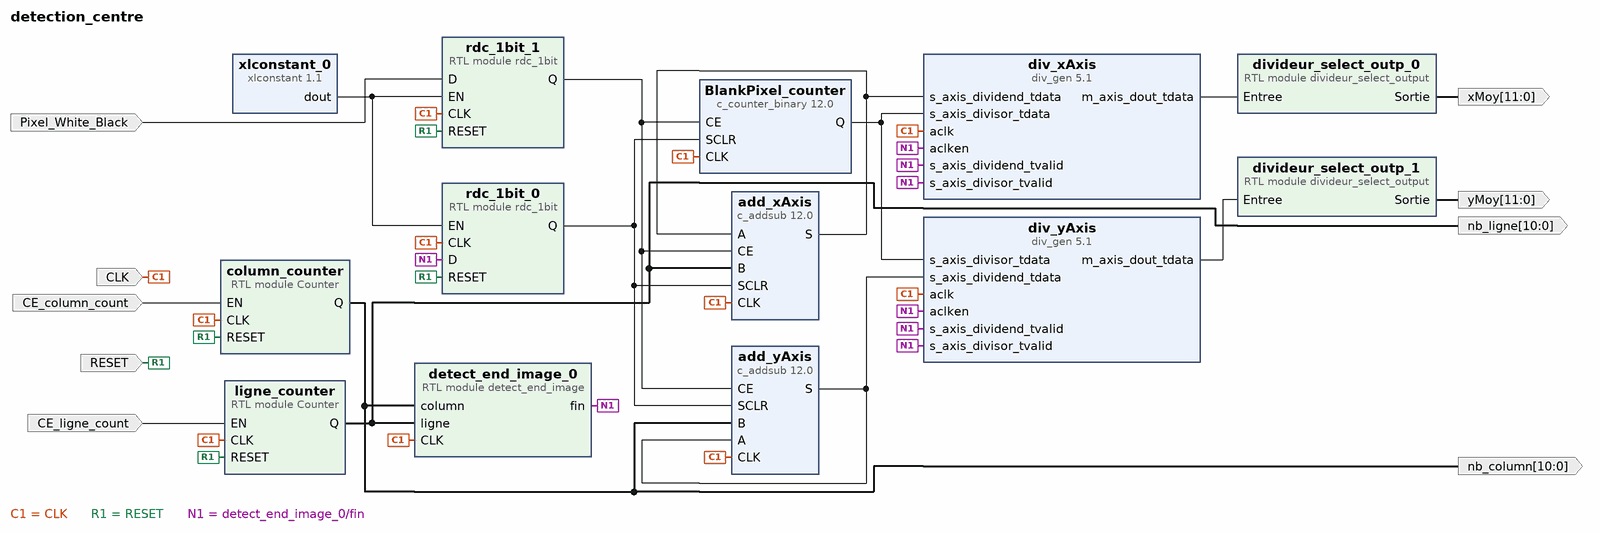
[diagram p0: block diagram of the top level]
# Vivado block design detection_centre, xc7z020clg400-1, Vivado 2018.2.1
create_bd_design detection_centre

create_bd_port -dir I CE_ligne_count
create_bd_port -dir I CLK
create_bd_port -dir I RESET
create_bd_port -dir O -from 10 -to 0 nb_ligne
create_bd_port -dir O -from 11 -to 0 xMoy
create_bd_port -dir O -from 11 -to 0 yMoy
create_bd_port -dir O -from 10 -to 0 nb_column
create_bd_port -dir I Pixel_White_Black
create_bd_port -dir I CE_column_count

create_bd_cell -type ip -vlnv xilinx.com:ip:c_addsub:12.0 add_yAxis
set_property -dict [list \
  CONFIG.A_Type Unsigned \
  CONFIG.B_Type Unsigned \
  CONFIG.A_Width 18 \
  CONFIG.B_Width 11 \
  CONFIG.Out_Width 18 \
  CONFIG.Latency 1 \
  CONFIG.B_Value 00000000000 \
  CONFIG.CE true \
  CONFIG.SCLR true \
  CONFIG.SSET false \
] [get_bd_cells add_yAxis]
create_bd_cell -type ip -vlnv xilinx.com:ip:div_gen:5.1 div_yAxis
set_property -dict [list \
  CONFIG.algorithm_type Radix2 \
  CONFIG.dividend_and_quotient_width 18 \
  CONFIG.dividend_has_tuser false \
  CONFIG.dividend_has_tlast false \
  CONFIG.divisor_width 11 \
  CONFIG.remainder_type Remainder \
  CONFIG.fractional_width 11 \
  CONFIG.operand_sign Unsigned \
  CONFIG.clocks_per_division 1 \
  CONFIG.divide_by_zero_detect false \
  CONFIG.OutTLASTBehv Null \
  CONFIG.latency 20 \
  CONFIG.ACLKEN true \
] [get_bd_cells div_yAxis]
create_bd_cell -type ip -vlnv xilinx.com:ip:c_counter_binary:12.0 BlankPixel_counter
set_property -dict [list \
  CONFIG.Output_Width 11 \
  CONFIG.Restrict_Count false \
  CONFIG.CE true \
  CONFIG.SCLR true \
  CONFIG.SSET false \
] [get_bd_cells BlankPixel_counter]
create_bd_cell -type ip -vlnv xilinx.com:ip:xlconstant:1.1 xlconstant_0
create_bd_cell -type ip -vlnv xilinx.com:ip:c_addsub:12.0 add_xAxis
set_property -dict [list \
  CONFIG.A_Type Unsigned \
  CONFIG.B_Type Unsigned \
  CONFIG.A_Width 18 \
  CONFIG.B_Width 11 \
  CONFIG.Out_Width 18 \
  CONFIG.Latency 1 \
  CONFIG.B_Value 00000000000 \
  CONFIG.CE true \
  CONFIG.SCLR true \
  CONFIG.SSET false \
] [get_bd_cells add_xAxis]
create_bd_cell -type ip -vlnv xilinx.com:ip:div_gen:5.1 div_xAxis
set_property -dict [list \
  CONFIG.algorithm_type Radix2 \
  CONFIG.dividend_and_quotient_width 18 \
  CONFIG.dividend_has_tuser false \
  CONFIG.dividend_has_tlast false \
  CONFIG.divisor_width 11 \
  CONFIG.remainder_type Remainder \
  CONFIG.fractional_width 11 \
  CONFIG.operand_sign Unsigned \
  CONFIG.clocks_per_division 1 \
  CONFIG.divide_by_zero_detect false \
  CONFIG.OutTLASTBehv Null \
  CONFIG.latency 20 \
  CONFIG.ACLKEN true \
] [get_bd_cells div_xAxis]
create_bd_cell -type module -reference rdc_1bit rdc_1bit_0
create_bd_cell -type module -reference rdc_1bit rdc_1bit_1
create_bd_cell -type module -reference divideur_select_output divideur_select_outp_0
create_bd_cell -type module -reference divideur_select_output divideur_select_outp_1
create_bd_cell -type module -reference detect_end_image detect_end_image_0
create_bd_cell -type module -reference Counter column_counter
set_property -dict {CONFIG.N 11} [get_bd_cells column_counter]
create_bd_cell -type module -reference Counter ligne_counter
set_property -dict {CONFIG.N 11} [get_bd_cells ligne_counter]

# ---- connections ----

connect_bd_net [get_bd_ports CLK] \
  [get_bd_pins BlankPixel_counter/CLK] [get_bd_pins add_xAxis/CLK] [get_bd_pins div_xAxis/aclk] [get_bd_pins div_yAxis/aclk] \
  [get_bd_pins add_yAxis/CLK] [get_bd_pins rdc_1bit_0/CLK] [get_bd_pins rdc_1bit_1/CLK] [get_bd_pins detect_end_image_0/CLK] \
  [get_bd_pins column_counter/CLK] [get_bd_pins ligne_counter/CLK]
connect_bd_net -net RESET_counter_ligne_and_column_1 [get_bd_ports RESET] \
  [get_bd_pins rdc_1bit_0/RESET] [get_bd_pins rdc_1bit_1/RESET] [get_bd_pins column_counter/RESET] \
  [get_bd_pins ligne_counter/RESET]
connect_bd_net [get_bd_pins ligne_counter/Q] [get_bd_ports nb_ligne] [get_bd_pins add_xAxis/B] [get_bd_pins detect_end_image_0/ligne]
connect_bd_net -net divideur_select_outp_0_Output [get_bd_pins divideur_select_outp_0/Sortie] [get_bd_ports xMoy]
connect_bd_net -net divideur_select_outp_1_Output [get_bd_pins divideur_select_outp_1/Sortie] [get_bd_ports yMoy]
connect_bd_net [get_bd_pins div_xAxis/m_axis_dout_tdata] [get_bd_pins divideur_select_outp_0/Entree]
connect_bd_net [get_bd_pins add_yAxis/S] [get_bd_pins add_yAxis/A] [get_bd_pins div_yAxis/s_axis_dividend_tdata]
connect_bd_net [get_bd_pins div_yAxis/m_axis_dout_tdata] [get_bd_pins divideur_select_outp_1/Entree]
connect_bd_net [get_bd_pins detect_end_image_0/fin] \
  [get_bd_pins div_xAxis/s_axis_divisor_tvalid] [get_bd_pins div_xAxis/s_axis_dividend_tvalid] [get_bd_pins div_xAxis/aclken] \
  [get_bd_pins div_yAxis/s_axis_divisor_tvalid] [get_bd_pins div_yAxis/s_axis_dividend_tvalid] [get_bd_pins div_yAxis/aclken] \
  [get_bd_pins rdc_1bit_0/D]
connect_bd_net [get_bd_pins xlconstant_0/dout] [get_bd_pins rdc_1bit_0/EN] [get_bd_pins rdc_1bit_1/EN]
connect_bd_net [get_bd_pins rdc_1bit_0/Q] [get_bd_pins add_xAxis/SCLR] [get_bd_pins add_yAxis/SCLR] [get_bd_pins BlankPixel_counter/SCLR]
connect_bd_net [get_bd_pins BlankPixel_counter/Q] [get_bd_pins div_xAxis/s_axis_divisor_tdata] [get_bd_pins div_yAxis/s_axis_divisor_tdata]
connect_bd_net [get_bd_pins add_xAxis/S] [get_bd_pins add_xAxis/A] [get_bd_pins div_xAxis/s_axis_dividend_tdata]
connect_bd_net [get_bd_pins column_counter/Q] [get_bd_ports nb_column] [get_bd_pins add_yAxis/B] [get_bd_pins detect_end_image_0/column]
connect_bd_net [get_bd_pins rdc_1bit_1/Q] [get_bd_pins add_xAxis/CE] [get_bd_pins BlankPixel_counter/CE] [get_bd_pins add_yAxis/CE]
connect_bd_net [get_bd_ports Pixel_White_Black] [get_bd_pins rdc_1bit_1/D]
connect_bd_net [get_bd_ports CE_column_count] [get_bd_pins column_counter/EN]
connect_bd_net [get_bd_ports CE_ligne_count] [get_bd_pins ligne_counter/EN]

validate_bd_design
save_bd_design
